# Altium schematic sheet DC075B_LVDS_OUTPUT.SchDoc: LVDS OUTPUT
size 558 x 431 mm; DrawnBy: Praveen Aroul; DocumentNumber: 10; SheetNumber: 10; SheetTotal: 13; PageSetup: Record=PageOptions|CenterHorizontal=True|CenterVertical=True|PrintScale=1.00|XCorrection=1.00|YCorrection=1.00|PrintKind=0|BorderSize=5000000|LeftOffset=0|BottomOffset=0|Orientation=2|PaperLength=1000|PaperWidth=1000|Scale=100|PaperSource=15|PrintQuality=600|MediaType=1|DitherType=10|PaperKind=Letter|PrintScaleMode=1
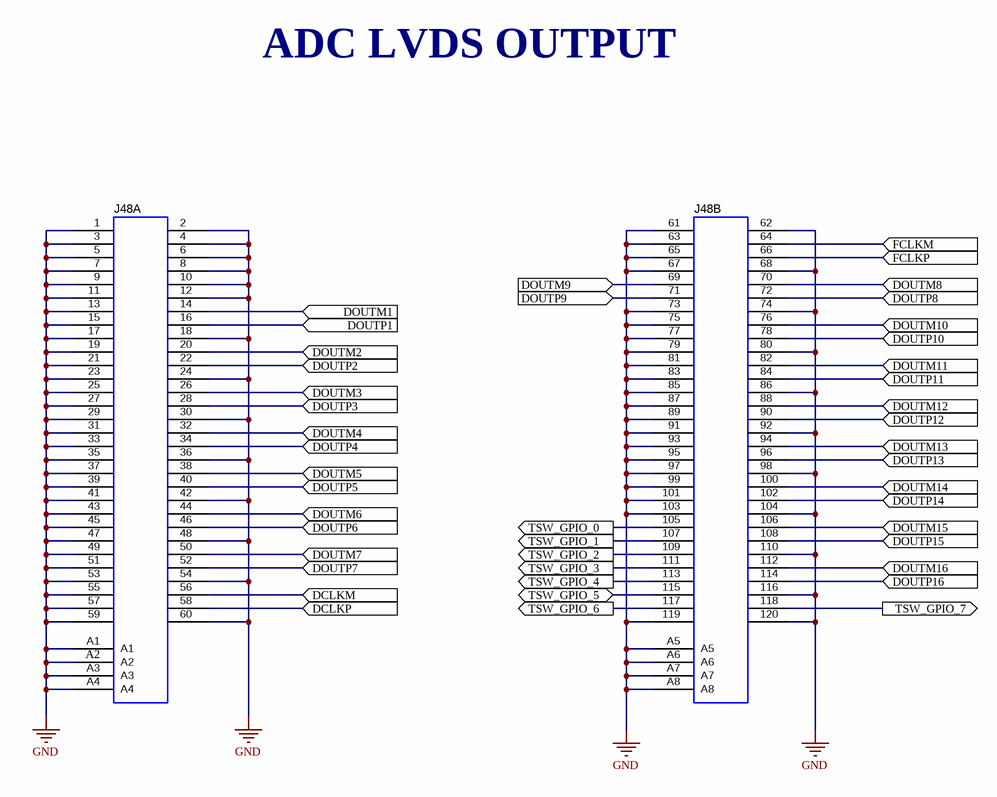
[diagram p0: DC075B_LVDS_OUTPUT.SchDoc]

## Parts
J48  SAMTEC_QTH-060-01-L-D-A  [SAMTEC_QTH-060-01-L-D-A]  (value not drawn)  (parts A,B of 2)

## Ports
DCLKM (in), DCLKP (in), DOUTM1 (in), DOUTM2 (in), DOUTM3 (in), DOUTM4 (in), DOUTM5 (in), DOUTM6 (in), DOUTM7 (in), DOUTM8 (in), DOUTM9 (in), DOUTM10 (in), DOUTM11 (in), DOUTM12 (in), DOUTM13 (in), DOUTM14 (in), DOUTM15 (in), DOUTM16 (in), DOUTP1 (in), DOUTP2 (in), DOUTP3 (in), DOUTP4 (in), DOUTP5 (in), DOUTP6 (in), DOUTP7 (in), DOUTP8 (in), DOUTP9 (in), DOUTP10 (in), DOUTP11 (in), DOUTP12 (in), DOUTP13 (in), DOUTP14 (in), DOUTP15 (in), DOUTP16 (in), FCLKM (in), FCLKP (in), TSW_GPIO_0 (out), TSW_GPIO_1 (out), TSW_GPIO_2 (out), TSW_GPIO_3 (out), TSW_GPIO_4 (out), TSW_GPIO_5, TSW_GPIO_6 (out), TSW_GPIO_7 (out)

## Nets
GND: J48.1 J48.2 J48.3 J48.4 J48.5 J48.6 J48.7 J48.8 J48.9 J48.10 J48.11 J48.12 J48.13 J48.15 J48.17 J48.18 J48.19 J48.21 J48.23 J48.24 J48.25 J48.27 J48.29 J48.30 J48.31 J48.33 J48.35 J48.36 J48.37 J48.39 J48.41 J48.42 J48.43 J48.45 J48.47 J48.48 J48.49 J48.51 J48.53 J48.54 J48.55 J48.57 J48.59 J48.60 J48.61 J48.62 J48.63 J48.65 J48.67 J48.68 J48.73 J48.74 J48.75 J48.77 J48.79 J48.80 J48.81 J48.83 J48.85 J48.86 J48.87 J48.89 J48.91 J48.92 J48.93 J48.95 J48.97 J48.98 J48.99 J48.101 J48.103 J48.104 J48.110 J48.116 J48.119 J48.120 J48.A1 J48.A2 J48.A3 J48.A4 J48.A5 J48.A6 J48.A7 J48.A8
DCLKM: J48.56 ; port DCLKM
DCLKP: J48.58 ; port DCLKP
DOUTM1: J48.14 ; port DOUTM1
DOUTM2: J48.20 ; port DOUTM2
DOUTM3: J48.26 ; port DOUTM3
DOUTM4: J48.32 ; port DOUTM4
DOUTM5: J48.38 ; port DOUTM5
DOUTM6: J48.44 ; port DOUTM6
DOUTM7: J48.50 ; port DOUTM7
DOUTM8: J48.70 ; port DOUTM8
DOUTM9: J48.69 ; port DOUTM9
DOUTM10: J48.76 ; port DOUTM10
DOUTM11: J48.82 ; port DOUTM11
DOUTM12: J48.88 ; port DOUTM12
DOUTM13: J48.94 ; port DOUTM13
DOUTM14: J48.100 ; port DOUTM14
DOUTM15: J48.106 ; port DOUTM15
DOUTM16: J48.112 ; port DOUTM16
DOUTP1: J48.16 ; port DOUTP1
DOUTP2: J48.22 ; port DOUTP2
DOUTP3: J48.28 ; port DOUTP3
DOUTP4: J48.34 ; port DOUTP4
DOUTP5: J48.40 ; port DOUTP5
DOUTP6: J48.46 ; port DOUTP6
DOUTP7: J48.52 ; port DOUTP7
DOUTP8: J48.72 ; port DOUTP8
DOUTP9: J48.71 ; port DOUTP9
DOUTP10: J48.78 ; port DOUTP10
DOUTP11: J48.84 ; port DOUTP11
DOUTP12: J48.90 ; port DOUTP12
DOUTP13: J48.96 ; port DOUTP13
DOUTP14: J48.102 ; port DOUTP14
DOUTP15: J48.108 ; port DOUTP15
DOUTP16: J48.114 ; port DOUTP16
FCLKM: J48.64 ; port FCLKM
FCLKP: J48.66 ; port FCLKP
TSW_GPIO_0: J48.105 ; port TSW_GPIO_0
TSW_GPIO_1: J48.107 ; port TSW_GPIO_1
TSW_GPIO_2: J48.109 ; port TSW_GPIO_2
TSW_GPIO_3: J48.111 ; port TSW_GPIO_3
TSW_GPIO_4: J48.113 ; port TSW_GPIO_4
TSW_GPIO_5: J48.115 ; port TSW_GPIO_5
TSW_GPIO_6: J48.117 ; port TSW_GPIO_6
TSW_GPIO_7: J48.118 ; port TSW_GPIO_7

## Notes on the sheet
- ADC LVDS OUTPUT
- Drawn By:
- SVN Rev:
- Number:
- TID #:
- Orderable:
- Rev:
- Sheet Title:
- File:
- Project Title:
- Designed for:
- Assembly Variant:
- Mod. Date:
- Sheet:
- Size:
- of
- C
- http://www.ti.com
- Texas Instruments and/or its licensors do not warrant the accuracy or completeness of this specification or any information contained therein. Texas Instruments and/or its licensors do not warrant that this design will meet the specifications, will be suitable for your application or fit for any particular purpose, or will operate in an implementation. Texas Instruments and/or its licensors do not warrant that the design is production worthy. You should completely validate and test your design implementation to confirm the system functionality for your application.
- Engineer:
- Contact:
- © Texas Instruments

## Library data of the parts
J48 = CMP-0056023-2: Socket, 0.5MM, 60x2, Gold, SMT; Manufacturer: Samtec; Green_Lifecycle: Not Set; Green_REACh: Incomplete; PartNumber: QTH-060-01-L-D-A; PackageReference: Socket, Female, 0.5MM, 60x2, SMT; CompType: Socket; RoHS: Y; MountType: SMT; ComponentLink1Description: Datasheet URL; ComponentLink1URL: http://www.samtec.com/documents/webfiles/cpdf/QTH-XXX-XX-X-D-XXX-MKT.pdf; Supplier 1: Digi-Key; Supplier Part Number 1: SAM8189-ND; Supplier 2: Newark; Supplier Part Number 2: 11P6110; Supplier 3: Farnell; Supplier Part Number 3: 1667909; Green_EU RoHS-2: Incomplete; Green_EU RoHS: Incomplete